# Altium schematic sheet Sheet1.SchDoc
size A
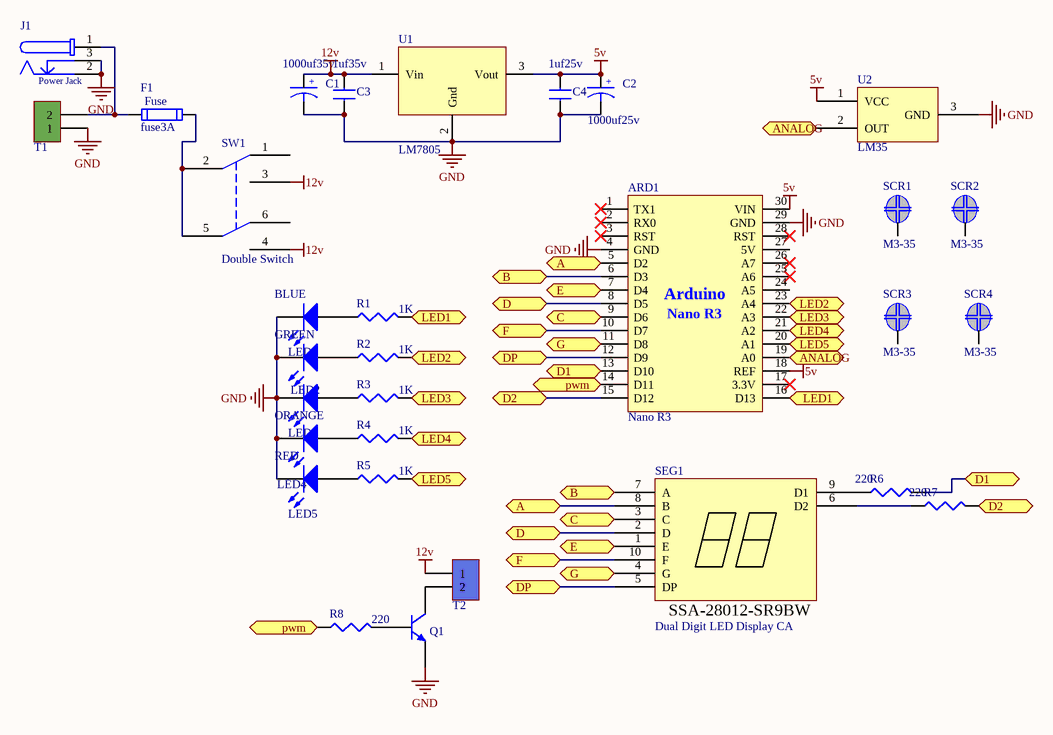
[diagram p0: Sheet1.SchDoc]

## Parts
ARD1  Nano R3  [Arduino_Nano_R3]
C1  1000uf35v  [RB7.6-15]
C2  1000uf25v  [RB7.6-15]
C3  1uf35v  [1206_C]
C4  1uf25v  [1206_C]
F1  fuse3A  [FUSE_5X20MM_4PIN]
J1  Power Jack  [DC-Jack-THT-RA-6.4]
LED1  BLUE  [LED-5mm(BLUE)]
LED2  GREEN  [LED-5mm(BLUE)]
LED3  YELLOW  [LED-5mm(BLUE)]  (value not drawn)
LED4  ORANGE  [LED-5mm(BLUE)]
LED5  RED  [LED-5mm(BLUE)]
Q1  BD135-37-39  [TO-126 (SOT32) Gold PCB With HatSink]  (value not drawn)
R1  1K  [1206_R]
R2  1K  [1206_R]
R3  1K  [1206_R]
R4  1K  [1206_R]
R5  1K  [1206_R]
R6  220  [AXIAL-0.3]
R7  220  [AXIAL-0.3]
R8  220  [1206_R]
SCR1  M3-35  [SCREW]  (no BOM)
SCR2  M3-35  [SCREW]  (no BOM)
SCR3  M3-35  [SCREW]  (no BOM)
SCR4  M3-35  [SCREW]  (no BOM)
SEG1  Dual Digit LED Display CA  [7Seg-MPX2-15*10mm]
SW1  Double Switch  [Switch - DPDT]
T1  Phoenix 2 Pin  [Phoenix_2PIN_RA_P7.62mm]  (value not drawn)
T2  Terminal 2 Pin  [Terminal_2Pin_P5.00mm]  (value not drawn)
U1  LM7805  [LM78XXCT_HEATSINK]
U2  LM35  [TO-92]

## Ports
A, ANALOG, B, C, D, D1, D2, DP, E, F, G, LED1, LED2, LED3, LED4, LED5, pwm

## Nets
5v: ARD1.18(REF) ARD1.30(VIN) C2.1(C1) C4.2(C2) U1.3(Vout) U2.1(VCC)
12v: C1.1(C1) C3.2(C2) SW1.3 SW1.4 T2.1 U1.1(Vin)
GND: ARD1.4(GND) ARD1.29(GND) C1.2(C2) C2.2(C2) C3.1(C1) C4.1(C1) J1.2 J1.3 LED1.2(K) LED2.2(K) LED3.2(K) LED4.2(K) LED5.2(K) Q1.1(E) T1.1 U1.2(Gnd) U2.3(GND)
A: ARD1.5(D2) SEG1.8(B) ; port A
ANALOG: ARD1.19(A0) U2.2(OUT) ; port ANALOG
B: ARD1.6(D3) SEG1.7(A) ; port B
C: ARD1.9(D6) SEG1.3(C) ; port C
D: ARD1.8(D5) SEG1.2(D) ; port D
D1: ARD1.13(D10) R6.2(R2) ; port D1
D2: ARD1.15(D12) R7.2(R2) ; port D2
DP: ARD1.12(D9) SEG1.5(DP) ; port DP
E: ARD1.7(D4) SEG1.1(E) ; port E
F: ARD1.10(D7) SEG1.10(F) ; port F
G: ARD1.11(D8) SEG1.4(G) ; port G
LED1: ARD1.16(D13) R1.2(R2) ; port LED1
LED2: ARD1.23(A4) R2.2(R2) ; port LED2
LED3: ARD1.22(A3) R3.2(R2) ; port LED3
LED4: ARD1.21(A2) R4.2(R2) ; port LED4
LED5: ARD1.20(A1) R5.2(R2) ; port LED5
pwm: ARD1.14(D11) R8.1(R1) ; port pwm
NetF1_1: F1.1 J1.1 T1.2
NetF1_2: F1.2 SW1.2 SW1.5
NetLED1_1: LED1.1(A) R1.1(R1)
NetLED2_1: LED2.1(A) R2.1(R1)
NetLED3_1: LED3.1(A) R3.1(R1)
NetLED4_1: LED4.1(A) R4.1(R1)
NetLED5_1: LED5.1(A) R5.1(R1)
NetQ1_2: Q1.2(C) T2.2
NetQ1_3: Q1.3(B) R8.2(R2)
NetR6_1: R6.1(R1) SEG1.9(D1)
NetR7_1: R7.1(R1) SEG1.6(D2)

Not connected (* = marked no-connect by the designer): ARD1 1(TX1)* 2(RX0)* 3(RST)* 17(3.3V)* 24(A5) 25(A6)* 26(A7)* 27(5V) 28(RST)*; SCR1 1; SCR2 1; SCR3 1; SCR4 1; SW1 1 6

## Notes on the sheet
- (in symbol Arduino Nano R3) Arduino
- (in symbol Capacitor Electrolytic) +
- (in symbol FUSE METAL 4PIN) Fuse

## Library data of the parts
ARD1 = Arduino Nano R3
C1 C2 = Capacitor Electrolytic: Electrolytic Capacitor; Tolerance: [±20 %]; Rating: [35V]; Value: 1000uF; Operating Temp: -55 TO +105 °C; Storage Temp: -55 TO +105 °C
C3 C4 = Capacitor Ceramic SMD: Ceramic Multilayer SMD Capacitor; Rating: [50V]; Tolerance: [5%]; Value: 100nF; Operating Temp: -55 TO 125 °C; Storage Temp: -55 TO 125 °C
F1 = FUSE METAL 4PIN
J1 = DC-JACK: DC Power Jack Connector Low Profile with 4 soldering pads; Gender: Male; Plug Inner Diameter: 1.05 mm; Plug Outer Diameter: 3.5 mm; Rated Current: 5 A; Working Voltage: 18 V; Orientation: Right Angled; Operating Temperature: -40 to 85 degC; Mounting Technology: SMT
LED1-LED5 = LED: Light Emitting Diode; Manufacturer: ---; Rating: 40mA; Value: LED; Operating Temp: -30°C to +100°C; Storage Temp: -55°C to +125°C
Q1 = BD135-37-39: NPN Transistor
R1-R5 = Resistor SMD: SMD Resistor; Voltage Rating: [1KV]; Rating: 0.1 W; Tolerance: [1%]; Operating Temp: -55 to 155 °C; Storage Temp: -55 to 155 °C; ComponentLink1Description: *; ComponentLink1URL: *; Value: 1K
R6 R7 = Resistor Axial: Axial Resistor; Rating: 1/4 W; Tolerance: [1%]; Value: 1K; Operating Temp: -55 to 155 °C; Storage Temp: -55 to 155 °C; ComponentLink1Description: *; ComponentLink1URL: *
R8 = Resistor SMD: SMD Resistor; Voltage Rating: [1KV]; Rating: 0.1 W; Value: 1K; Tolerance: [1%]; Operating Temp: -55 to 155 °C; Storage Temp: -55 to 155 °C; ComponentLink1Description: *; ComponentLink1URL: *
SCR1-SCR4 = SCREW_M3-35: Link to Datasheet: *; Link to Picture: *; Manufacture Part #: M3-35; Value: M3-35; ComponentLink1Description: *; ComponentLink1URL: *
SEG1 = SSA-28012-SR9BW: Dual Digit 7Seg CA 15*10mm; Manufacturer: SUNRISE; Link to datasheet: *; Link to Picture: *; Operating Temp: -20°C to +80°C; Rating: *; Stability Frequency: *; Storage Temp: -40°C to +85°C; Tolerance: *; ComponentLink1Description: *; ComponentLink1URL: *; Manufacture Part #: SSA-28012-SR9BW; Value: Dual Digit LED Display CA
SW1 = SW-DPDT: DPDT Switch
U1 = LM78XX
U2 = LM35: LM35 Temperature Sensor; ComponentLinkURL: www.picpars.com